# Altium project Parking_Guidance_stm.PrjPcb
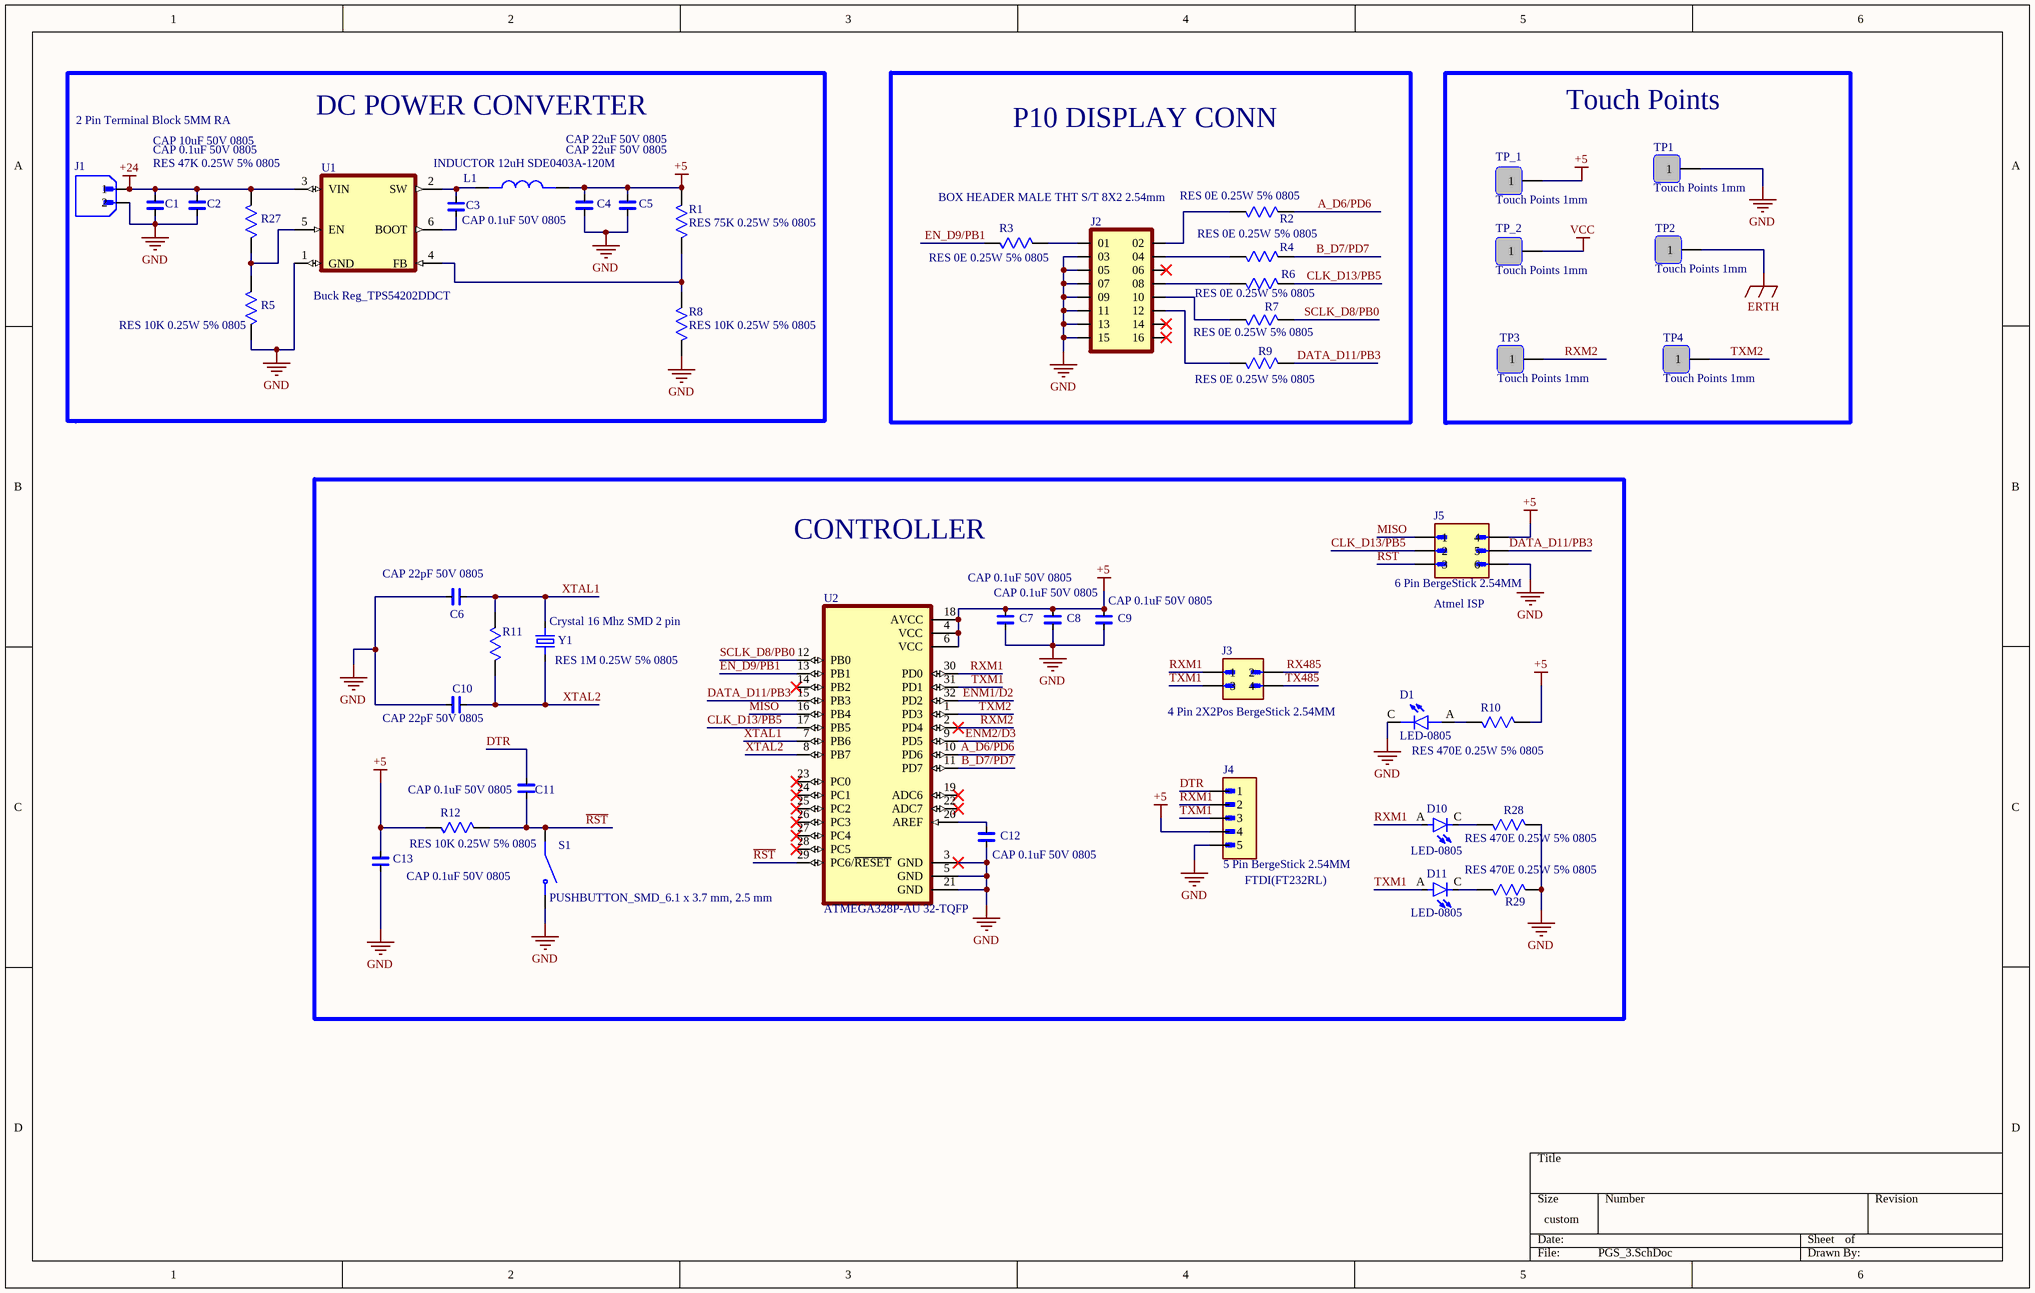
[diagram p0: PGS_3.SchDoc]
2 sheets, 101 parts. Net scope: global (net labels, ports and power ports of the same name join across sheets).
Board file: Parking_Guidance.PcbDoc
Sheets:
  PGS_3.SchDoc
  PGS_4.SchDoc

## Sheet PGS_3.SchDoc
size 381 x 241 mm; SheetNumber: 1; SheetTotal: 2

### Parts
C1  CAP 10uF 50V 0805  [CAP CER 0.1uF/50V 5%]
C2  CAP 0.1uF 50V 0805  [CAP CER 0.1uF/50V 5%]
C3  CAP 0.1uF 50V 0805  [CAP CER 0.1uF/50V 5%]
C4  CAP 22uF 50V 0805  [CAP CER 0.1uF/50V 5%]
C5  CAP 22uF 50V 0805  [CAP CER 0.1uF/50V 5%]
C6  CAP 22pF 50V 0805  [CAP CER 0.1uF/50V 5%]
C7  CAP 0.1uF 50V 0805  [CAP CER 0.1uF/50V 5%]
C8  CAP 0.1uF 50V 0805  [CAP CER 0.1uF/50V 5%]
C9  CAP 0.1uF 50V 0805  [CAP CER 0.1uF/50V 5%]
C10  CAP 22pF 50V 0805  [CAP CER 0.1uF/50V 5%]
C11  CAP 0.1uF 50V 0805  [CAP CER 0.1uF/50V 5%]
C12  CAP 0.1uF 50V 0805  [CAP CER 0.1uF/50V 5%]
C13  CAP 0.1uF 50V 0805  [CAP CER 0.1uF/50V 5%]
D1  LED-0805  [LED-0805]
D10  LED-0805  [LED-0805]
D11  LED-0805  [LED-0805]
J1  2 Pin Terminal Block 5MM RA  [2 Pin Terminal Block 5MM RA]
J2  BOX HEADER MALE THT S/T 8X2 2.54mm  [BOX HEADER MALE 8X2 2.54mm]
J3  4 Pin 2X2Pos BergeStick 2.54MM  [4 Pin BergeStick 2.54MM]
J4  5 Pin BergeStick 2.54MM  [5 Pin BergeStick 2.54MM]
J5  6 Pin BergeStick 2.54MM  [6 Pin BergeStick 2.54MM - duplicate]
L1  INDUCTOR 12uH SDE0403A-120M  [INDUCTOR 12uH SDE0403A-120M]
R1  RES 75K 0.25W 5% 0805  [RES 0805 10K/0.25W 5%]
R2  RES 0E 0.25W 5% 0805  [RES 0805 10K/0.25W 5%]
R3  RES 0E 0.25W 5% 0805  [RES 0805 10K/0.25W 5%]
R4  RES 0E 0.25W 5% 0805  [RES 0805 10K/0.25W 5%]
R5  RES 10K 0.25W 5% 0805  [RES 0805 10K/0.25W 5%]
R6  RES 0E 0.25W 5% 0805  [RES 0805 10K/0.25W 5%]
R7  RES 0E 0.25W 5% 0805  [RES 0805 10K/0.25W 5%]
R8  RES 10K 0.25W 5% 0805  [RES 0805 10K/0.25W 5%]
R9  RES 0E 0.25W 5% 0805  [RES 0805 10K/0.25W 5%]
R10  RES 470E 0.25W 5% 0805  [RES 0805 10K/0.25W 5%]
R11  RES 1M 0.25W 5% 0805  [RES 0805 10K/0.25W 5%]
R12  RES 10K 0.25W 5% 0805  [RES 0805 10K/0.25W 5%]
R27  RES 47K 0.25W 5% 0805  [RES 0805 10K/0.25W 5%]
R28  RES 470E 0.25W 5% 0805  [RES 0805 10K/0.25W 5%]
R29  RES 470E 0.25W 5% 0805  [RES 0805 10K/0.25W 5%]
S1  PUSHBUTTON_SMD_6.1 x 3.7 mm, 2.5 mm  [PUSHBUTTON_SMD_6.1 x 3.7 mm, 2.5 mm]
TP1  Touch Points 1mm  [Touch Points 1mm]
TP2  Touch Points 1mm  [Touch Points 1mm]
TP3  Touch Points 1mm  [Touch Points 1mm]
TP4  Touch Points 1mm  [Touch Points 1mm]
TP_1  Touch Points 1mm  [Touch Points 1mm]
TP_2  Touch Points 1mm  [Touch Points 1mm]
U1  Buck Reg_TPS54202DDCT  [Buck Reg_TPS54202DDCT]
U2  ATMEGA328P-AU 32-TQFP  [ATMEGA328P-AU 32-TQFP]
Y1  Crystal 16 Mhz SMD 2 pin  [Crystal 16 Mhz SMD 2 pin]

### Blocks framed on the sheet
DC POWER CONVERTER: C1-C5 J1 L1 R1 R5 R8 R27 U1
P10 DISPLAY CONN: J2 R2-R4 R6 R7 R9
Touch Points: TP1-TP4 TP_1 TP_2
CONTROLLER: C6-C13 D1 D10 D11 J3-J5 R10-R12 R28 R29 S1 U2 Y1

### Nets
+5: C4.2 C5.2 C7.2 C8.2 C9.2 C13.2 J4.4 J5.4 L1.2 R1.2 R10.2 R12.1 TP_1.1 U2.4(VCC) U2.6(VCC) U2.18(AVCC)
+24: C1.2 C2.2 J1.1 R27.2 U1.3(VIN)
ERTH: TP2.1  [project net EARTH]
GND: C1.1 C2.1 C4.1 C5.1 C6.1 C7.1 C8.1 C9.1 C10.1 C12.1 C13.1 D1.C J1.2 J2.03 J2.05 J2.07 J2.09 J2.11 J2.13 J2.15 J4.5 J5.6 R5.1 R8.1 R28.2 R29.2 S1.2 TP1.1 U1.1(GND) U2.3(GND) U2.5(GND) U2.21(GND)
VCC: TP_2.1
A_D6/PD6: R2.2 U2.10(PD6)
B_D7/PD7: R4.2 U2.11(PD7)
CLK_D13/PB5: J5.2 R6.2 U2.17(PB5)
DATA_D11/PB3: J5.5 R9.2 U2.15(PB3)
DTR: C11.2 J4.1
EN_D9/PB1: R3.1 U2.13(PB1)
ENM1/D2: U2.32(PD2)
ENM2/D3: U2.9(PD5)
MISO: J5.1 U2.16(PB4)
~{RST}: C11.1 J5.3 R12.2 S1.1 U2.29(PC6/~{RESET})
RX485: J3.2
RXM1: D10.A J3.1 J4.2 U2.30(PD0)
RXM2: TP3.1 U2.2(PD4)
SCLK_D8/PB0: R7.2 U2.12(PB0)
TX485: J3.4
TXM1: D11.A J3.3 J4.3 U2.31(PD1)
TXM2: TP4.1 U2.1(PD3)
XTAL1: C6.2 R11.2 U2.7(PB6) Y1.2
XTAL2: C10.2 R11.1 U2.8(PB7) Y1.1
NetC3_1: C3.1 U1.6(BOOT)
NetC3_2: C3.2 L1.1 U1.2(SW)
NetC12_2: C12.2 U2.20(AREF)
NetD1_A: D1.A R10.1
NetD10_C: D10.C R28.1
NetD11_C: D11.C R29.1
NetJ2_01: J2.01 R3.2
NetJ2_02: J2.02 R2.1
NetJ2_04: J2.04 R4.1
NetJ2_08: J2.08 R6.1
NetJ2_10: J2.10 R7.1
NetJ2_12: J2.12 R9.1
NetR1_1: R1.1 R8.2 U1.4(FB)
NetR5_2: R5.2 R27.1 U1.5(EN)

Not connected (* = marked no-connect by the designer): J2 06* 14* 16*; U2 14(PB2)* 19(ADC6)* 22(ADC7)* 23(PC0)* 24(PC1)* 25(PC2)* 26(PC3)* 27(PC4)* 28(PC5)*

### Notes on the sheet
- (near J5) Atmel ISP
- (near J4) FTDI(FT232RL)

### Library data of the parts
C1-C13 = CAP CER 0.1uF/50V 5%: CAP CER 0.1uF/50V  Ceramic Capacitor X7R 0805 (2012 Metric); MF: Samsung; MP: CL21B104KCFNNNE; Purchase-URL: https://pricing.snapeda.com/search?q=CL21B104KCFNNNE&ref=eda; Package: 0805 Samsung; Check_prices: https://www.snapeda.com/parts/CL21B104KCFNNNE/Samsung+Electro-Mechanics/view-part/?ref=eda; Value: *; SnapEDA_Link: https://www.snapeda.com/parts/CL21B104KCFNNNE/Samsung+Electro-Mechanics/view-part/?ref=snap; Digi-Key_Part_Number: 1276-6840-2-ND
D1 = LED-0805: Red 640nm LED Indication - Discrete 1.85V 0805 (2012 Metric) APT2012SRCPRV; MF: Kingbright; SnapEDA_Link: https://www.snapeda.com/parts/APT2012SRCPRV/Kingbright/view-part/?ref=snap; Package: 0805 Kingbright; Value: *; MP: APT2012SRCPRV; Check_prices: https://www.snapeda.com/parts/APT2012SRCPRV/Kingbright/view-part/?ref=eda
D10 D11 = LED-0805: Red 640nm LED Indication - Discrete 1.85V 0805 (2012 Metric) SMT APT2012SRCPRV; MF: Kingbright; SnapEDA_Link: https://www.snapeda.com/parts/APT2012SRCPRV/Kingbright/view-part/?ref=snap; Package: 0805 Kingbright; Value: *; MP: APT2012SRCPRV; Check_prices: https://www.snapeda.com/parts/APT2012SRCPRV/Kingbright/view-part/?ref=eda
J1 = 2 Pin Terminal Block 5MM RA: 2 Pin Terminal Block HDR 5MM THT RA _OQ0271510000G; MF: Amphenol Anytek; SnapEDA_Link: https://www.snapeda.com/parts/OQ0271510000G/Amphenol/view-part/?ref=snap; Package: None; Value: *; MP: OQ0271510000G; Check_prices: https://www.snapeda.com/parts/OQ0271510000G/Amphenol/view-part/?ref=eda
J2 = BOX HEADER MALE THT S/T 8X2 2.54mm: THT BOX HEADER MALE S/T 8X2 2.54mm 16 pin; MP: TSS-108-01-T-D; Availability: Unavailable; Value: *; Price: None; Package: None
J3 = 4 Pin 2X2Pos BergeStick 2.54MM: 4 Pin 2X2Pos THT S/T BergeStick 2.54MM Amphenol 67997-104HLF 3A; MF: Amphenol ICC; Value: *; Package: None; Purchase-URL: https://pricing.snapeda.com/search/part/67997-104HLF/?ref=eda; Digi-Key_Part_Number: 609-3225-ND; Check_prices: https://www.snapeda.com/parts/67997-104HLF/Amphenol+FCI/view-part/?ref=eda; MP: 67997-104HLF; SnapEDA_Link: https://www.snapeda.com/parts/67997-104HLF/Amphenol+FCI/view-part/?ref=snap
J4 = 5 Pin BergeStick 2.54MM: 5 Pin 5Pos THT S/T BergeStick 2.54MM Amphenol68002-405HLF 3A; Package: None; Price: None; Value: *; MP: 68002-405HLF; Availability: Unavailable
J5 = 6 Pin BergeStick 2.54MM_1: 6 Pin 3X3Pos THT S/T BergeStick 2.54MM Amphenol 69192-406HLF; MF: AMPHENOL ICC / FCI; Package: None; Digi-Key_Part_Number: 609-4711-ND; Check_prices: https://www.snapeda.com/parts/69192-406HLF/Amphenol/view-part/?ref=eda; Value: *; MP: 69192-406HLF; Purchase-URL: https://pricing.snapeda.com/search/part/69192-406HLF/?ref=eda; SnapEDA_Link: https://www.snapeda.com/parts/69192-406HLF/Amphenol/view-part/?ref=snap
L1 = INDUCTOR 12uH SDE0403A-120M: INDUCTOR_2020(5.5mmX4.5mm)  SMT INDUCTOR 12uH SDE0403A-120M0 LQH5BPB4R7NT0L; Package: None; Price: None; Value: *; MP: LQH5BPB4R7NT0L; Availability: Unavailable
R1-R12 R27 = RES 10K 0.25W 5% 0805: RESISTOR, THICK FILM, 10K, 5%, 0805 0.25W; MP: ERJ-6GEYJ103V; MF: Panasonic Electronic; Price: None; Check_prices: https://www.snapeda.com/parts/ERJ-6GEYJ103V/Panasonic+Electronic+Components/view-part/?ref=eda; Package: 805-2 Panasonic; Purchase-URL: https://pricing.snapeda.com/search/part/ERJ-6GEYJ103V/?ref=eda; Availability: In Stock; SnapEDA_Link: https://www.snapeda.com/parts/ERJ-6GEYJ103V/Panasonic+Electronic+Components/view-part/?ref=snap; Value: *
R28 R29 = RES 10K 0.25W 5% 0805: RESISTOR, THICK FILM, 10K, 5%, 0805 0.25W SMT; MP: ERJ-6GEYJ103V; MF: Panasonic Electronic; Price: None; Check_prices: https://www.snapeda.com/parts/ERJ-6GEYJ103V/Panasonic+Electronic+Components/view-part/?ref=eda; Package: 805-2 Panasonic; Purchase-URL: https://pricing.snapeda.com/search/part/ERJ-6GEYJ103V/?ref=eda; Availability: In Stock; SnapEDA_Link: https://www.snapeda.com/parts/ERJ-6GEYJ103V/Panasonic+Electronic+Components/view-part/?ref=snap; Value: *
S1 = PUSHBUTTON_SMD_6.1 x 3.7 mm, 2.5 mm: 6.1 x 3.7 mm, 2.5 mm Actuator Height, 260 gf, Red, Surface Mount, SPST, Tactile Switch, TS09-63-25-R-260-SMT-TR; MF: Same Sky; SnapEDA_Link: https://www.snapeda.com/parts/TS09-63-25-R-260-SMT-TR/Same+Sky/view-part/?ref=snap; Package: None; Value: *; MP: TS09-63-25-R-260-SMT-TR; Check_prices: https://www.snapeda.com/parts/TS09-63-25-R-260-SMT-TR/Same+Sky/view-part/?ref=eda
TP1-TP4 TP_1 TP_2 = Touch Points: Touch Points 0.75mm to1mm
U1 = TPS54202DDCT: 4.5V to 28V Input, 2A Output, EMI Friendly Synchronous Step-Down Converter TPS54202DDCT; MF: Texas Instruments; SnapEDA_Link: https://www.snapeda.com/parts/TPS54202DDCT/Texas+Instruments/view-part/?ref=snap; Package: SOT-23-THN-6 Texas Instruments; Value: *; MP: TPS54202DDCT; Check_prices: https://www.snapeda.com/parts/TPS54202DDCT/Texas+Instruments/view-part/?ref=eda
U2 = ATMEGA328P-AU_1: AVR AVRÂ® ATmega Microcontroller IC 8-Bit 20MHz 32KB (16K x 16) FLASH 32-TQFP (7x7); MF: Microchip; SnapEDA_Link: https://www.snapeda.com/parts/ATMEGA328P-AU/Microchip/view-part/?ref=snap; Package: TQFP-32 Microchip; Value: *; MP: ATMEGA328P-AU; Check_prices: https://www.snapeda.com/parts/ATMEGA328P-AU/Microchip/view-part/?ref=eda
Y1 = Crystal 16 Mhz SMD 2 pin_1: 16 MHz Â±30ppm Crystal 20pF 60 Ohms HC-49/US FOXSDLF/128-20 16 Mhz Crystal SMD –CSM-4ALX(28ALX) 12.5mmX4.85mmX4mm; MF: Fox Electronics; SnapEDA_Link: https://www.snapeda.com/parts/FOXSDLF/128-20/Fox+Electronics/view-part/?ref=snap; Package: HC49SD Fox Electronics; Value: *; MP: FOXSDLF/128-20; Check_prices: https://www.snapeda.com/parts/FOXSDLF/128-20/Fox+Electronics/view-part/?ref=eda

## Sheet PGS_4.SchDoc
size 381 x 241 mm; SheetNumber: 2; SheetTotal: 2
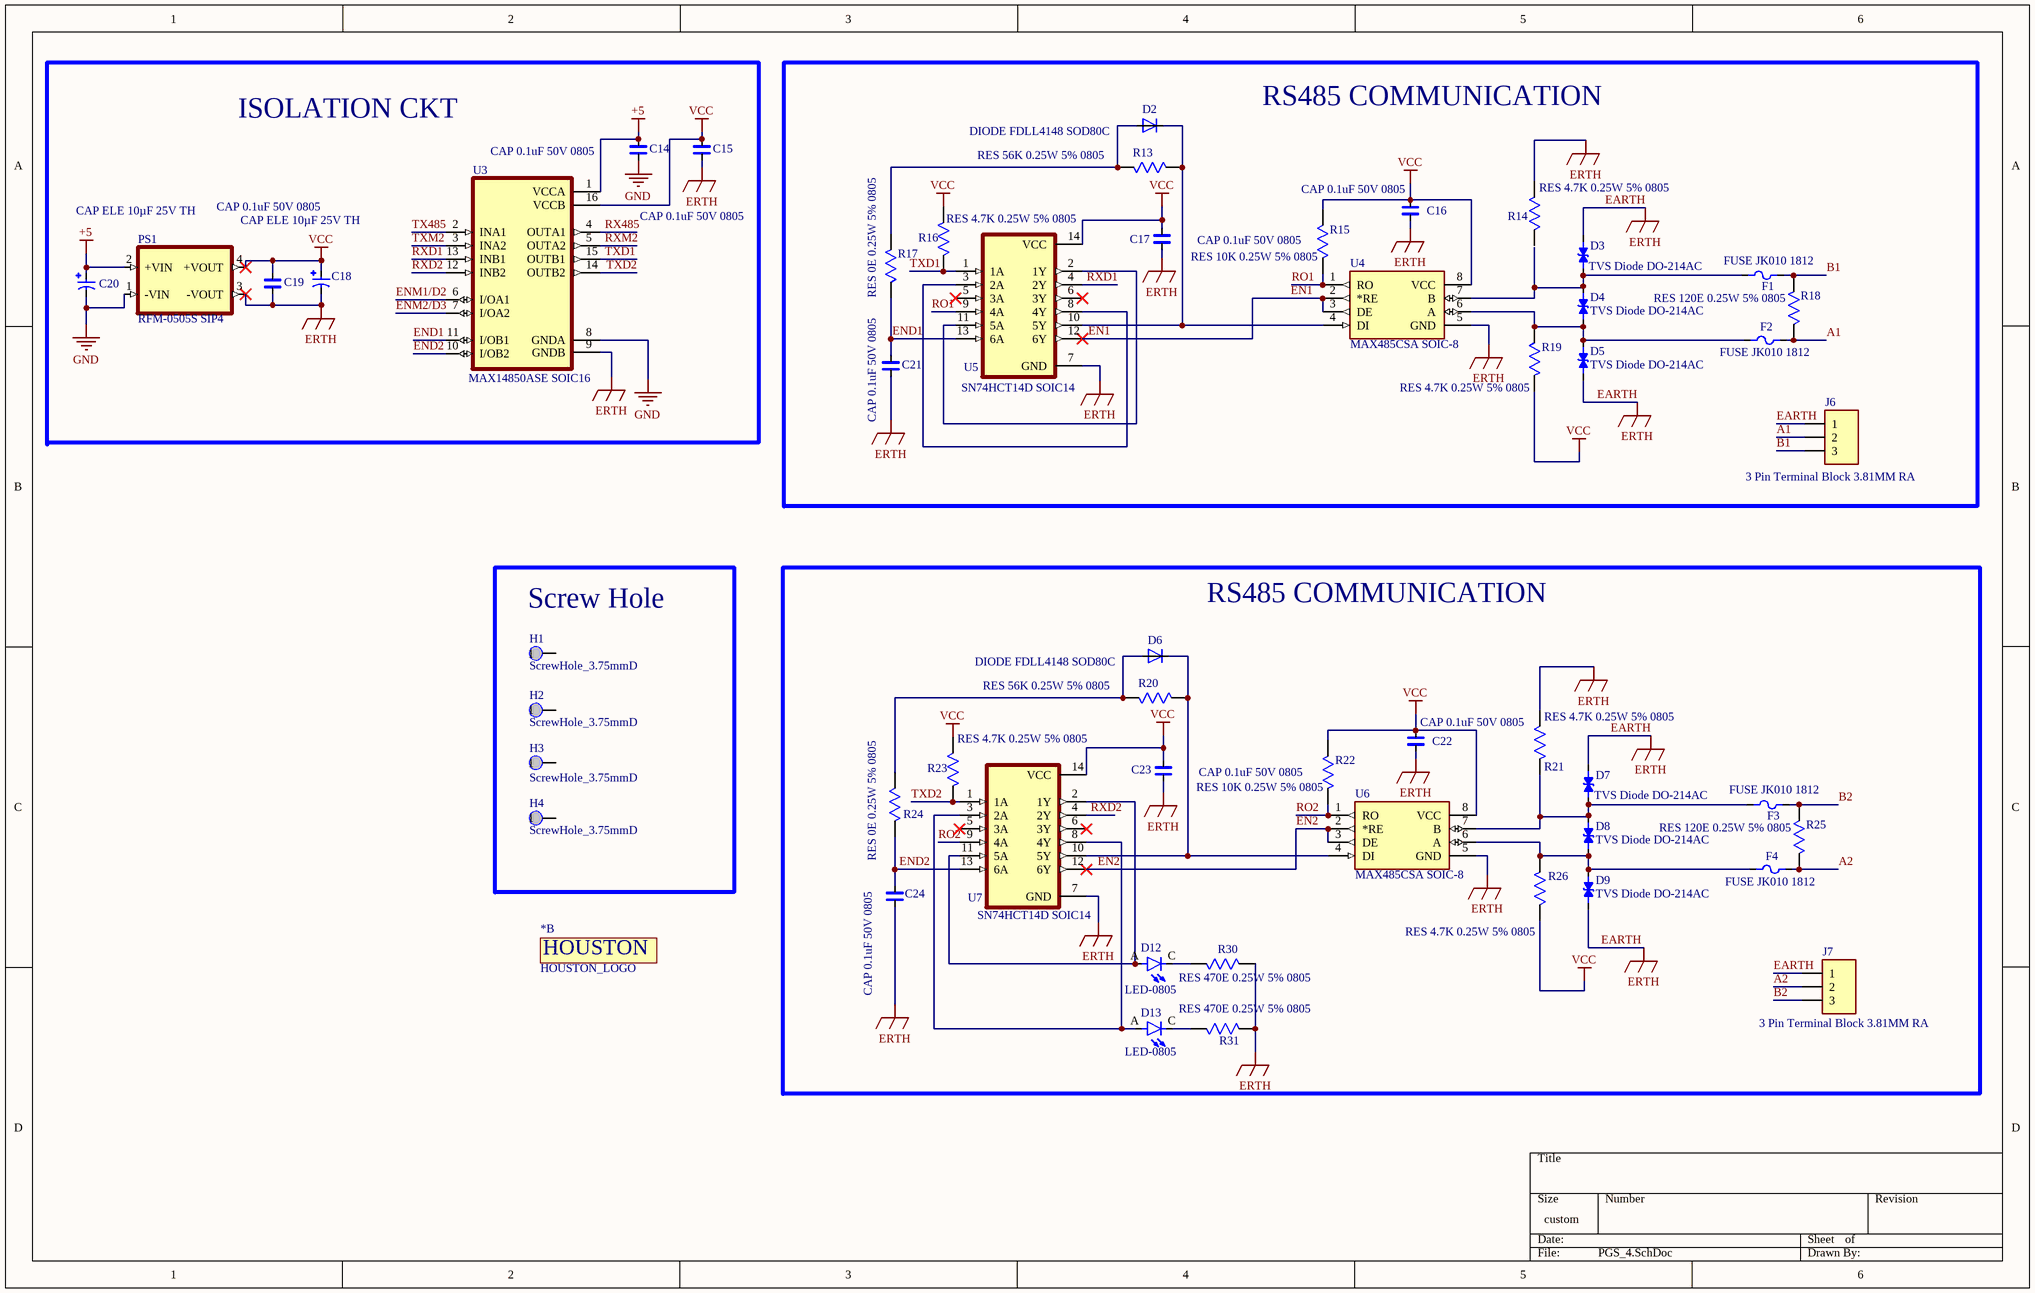
[diagram p1: PGS_4.SchDoc]

### Parts
*  HOUSTON_LOGO  [HOUSTON_LOGO]  (part B of 2)
C14  CAP 0.1uF 50V 0805  [CAP CER 0.1uF/50V 5%]
C15  CAP 0.1uF 50V 0805  [CAP CER 0.1uF/50V 5%]
C16  CAP 0.1uF 50V 0805  [CAP CER 0.1uF/50V 5%]
C17  CAP 0.1uF 50V 0805  [CAP CER 0.1uF/50V 5%]
C18  CAP ELE 10µF 25V TH  [CAP ELE 10µF 25V TH]
C19  CAP 0.1uF 50V 0805  [CAP CER 0.1uF/50V 5%]
C20  CAP ELE 10µF 25V TH  [CAP ELE 10µF 25V TH]
C21  CAP 0.1uF 50V 0805  [CAP CER 0.1uF/50V 5%]
C22  CAP 0.1uF 50V 0805  [CAP CER 0.1uF/50V 5%]
C23  CAP 0.1uF 50V 0805  [CAP CER 0.1uF/50V 5%]
C24  CAP 0.1uF 50V 0805  [CAP CER 0.1uF/50V 5%]
D2  DIODE FDLL4148 SOD80C  [DIODE SOD80C]
D3  TVS Diode DO-214AC  [TVS Diode DO-214AC]
D4  TVS Diode DO-214AC  [TVS Diode DO-214AC]
D5  TVS Diode DO-214AC  [TVS Diode DO-214AC]
D6  DIODE FDLL4148 SOD80C  [DIODE SOD80C]
D7  TVS Diode DO-214AC  [TVS Diode DO-214AC]
D8  TVS Diode DO-214AC  [TVS Diode DO-214AC]
D9  TVS Diode DO-214AC  [TVS Diode DO-214AC]
D12  LED-0805  [LED-0805]
D13  LED-0805  [LED-0805]
F1  FUSE JK010 1812  [FUSE JK010 1812]
F2  FUSE JK010 1812  [FUSE JK010 1812]
F3  FUSE JK010 1812  [FUSE JK010 1812]
F4  FUSE JK010 1812  [FUSE JK010 1812]
H1  ScrewHole_3.75mmD  [ScrewHole_3.75mmD - duplicate]
H2  ScrewHole_3.75mmD  [ScrewHole_3.75mmD - duplicate]
H3  ScrewHole_3.75mmD  [ScrewHole_3.75mmD - duplicate]
H4  ScrewHole_3.75mmD  [ScrewHole_3.75mmD - duplicate]
J6  3 Pin Terminal Block 3.81MM RA  [3 Pin Terminal Block 3.81MM RA]
J7  3 Pin Terminal Block 3.81MM RA  [3 Pin Terminal Block 3.81MM RA]
PS1  RFM-0505S SIP4  [RFM-0505S]
R13  RES 56K 0.25W 5% 0805  [RES 0805 10K/0.25W 5%]
R14  RES 4.7K 0.25W 5% 0805  [RES 0805 10K/0.25W 5%]
R15  RES 10K 0.25W 5% 0805  [RES 0805 10K/0.25W 5%]
R16  RES 4.7K 0.25W 5% 0805  [RES 0805 10K/0.25W 5%]
R17  RES 0E 0.25W 5% 0805  [RES 0805 10K/0.25W 5%]
R18  RES 120E 0.25W 5% 0805  [RES 0805 10K/0.25W 5%]
R19  RES 4.7K 0.25W 5% 0805  [RES 0805 10K/0.25W 5%]
R20  RES 56K 0.25W 5% 0805  [RES 0805 10K/0.25W 5%]
R21  RES 4.7K 0.25W 5% 0805  [RES 0805 10K/0.25W 5%]
R22  RES 10K 0.25W 5% 0805  [RES 0805 10K/0.25W 5%]
R23  RES 4.7K 0.25W 5% 0805  [RES 0805 10K/0.25W 5%]
R24  RES 0E 0.25W 5% 0805  [RES 0805 10K/0.25W 5%]
R25  RES 120E 0.25W 5% 0805  [RES 0805 10K/0.25W 5%]
R26  RES 4.7K 0.25W 5% 0805  [RES 0805 10K/0.25W 5%]
R30  RES 470E 0.25W 5% 0805  [RES 0805 10K/0.25W 5%]
R31  RES 470E 0.25W 5% 0805  [RES 0805 10K/0.25W 5%]
U3  MAX14850ASE SOIC16  [MAX14850ASE]
U4  MAX485CSA SOIC-8  [MAX485CSA]
U5  SN74HCT14D SOIC14  [SN74HCT14D SOIC14]
U6  MAX485CSA SOIC-8  [MAX485CSA]
U7  SN74HCT14D SOIC14  [SN74HCT14D SOIC14]

### Blocks framed on the sheet
ISOLATION CKT: C14 C15 C18-C20 PS1 U3
RS485 COMMUNICATION: C16 C17 C21 D2-D5 F1 F2 J6 R13-R19 U4 U5
Screw Hole: H1-H4
RS485 COMMUNICATION: C22-C24 D6-D9 D12 D13 F3 F4 J7 R20-R26 R30 R31 U6 U7

### Nets
+5: C14.2 C20.P PS1.2(+VIN) U3.1(VCCA)
EARTH: C15.1 C16.1 C17.1 C18.N C19.1 C21.1 C22.1 C23.1 C24.1 D3.2 D5.1 D7.2 D9.1 J6.1 J7.1 PS1.3(-VOUT) R14.2 R21.2 R30.2 R31.2 U3.9(GNDB) U4.5(GND) U5.7(GND) U6.5(GND) U7.7(GND)  [also labelled ERTH]
GND: C14.1 C20.N PS1.1(-VIN) U3.8(GNDA)
VCC: C15.2 C16.2 C17.2 C18.P C19.2 C22.2 C23.2 PS1.4(+VOUT) R15.2 R16.2 R19.1 R22.2 R23.2 R26.1 U3.16(VCCB) U4.8(VCC) U5.14(VCC) U6.8(VCC) U7.14(VCC)
A1: F2.2 J6.2 R18.1
A2: F4.2 J7.2 R25.1
B1: F1.2 J6.3 R18.2
B2: F3.2 J7.3 R25.2
EN1: U4.2(*RE) U4.3(DE) U5.12(6Y)
EN2: U6.2(*RE) U6.3(DE) U7.12(6Y)
END1: C21.2 R17.1 U3.11(I/OB1) U5.13(6A)
END2: C24.2 R24.1 U3.10(I/OB2) U7.13(6A)
ENM1/D2: U3.6(I/OA1)
ENM2/D3: U3.7(I/OA2)
RO1: R15.1 U4.1(RO) U5.9(4A)
RO2: R22.1 U6.1(RO) U7.9(4A)
RX485: U3.4(OUTA1)
RXD1: U3.13(INB1) U5.4(2Y)
RXD2: U3.12(INB2) U7.4(2Y)
RXM2: U3.5(OUTA2)
TX485: U3.2(INA1)
TXD1: R16.1 U3.15(OUTB1) U5.1(1A)
TXD2: R23.1 U3.14(OUTB2) U7.1(1A)
TXM2: U3.3(INA2)
NetD2_1: D2.1(K) R13.1 U4.4(DI) U5.10(5Y)
NetD2_2: D2.2(A) R13.2 R17.2
NetD3_1: D3.1 D4.2 F1.1 U4.7(B)
NetD4_1: D4.1 D5.2 F2.1 R19.2 U4.6(A)
NetD6_1: D6.1(K) R20.1 U6.4(DI) U7.10(5Y)
NetD6_2: D6.2(A) R20.2 R24.2
NetD7_1: D7.1 D8.2 F3.1 R21.1 U6.7(B)
NetD8_1: D8.1 D9.2 F4.1 R26.2 U6.6(A)
NetD12_A: D12.A U7.2(1Y) U7.11(5A)
NetD12_C: D12.C R30.1
NetD13_A: D13.A U7.3(2A) U7.8(4Y)
NetD13_C: D13.C R31.1
NetU5_2: U5.2(1Y) U5.11(5A)
NetU5_3: U5.3(2A) U5.8(4Y)

Not connected (* = marked no-connect by the designer): H1 1; H2 1; H3 1; H4 1; R14 1; U5 5(3A)* 6(3Y)*; U7 5(3A)* 6(3Y)*

### Notes on the sheet
- (in symbol HOUSTON_LOGO, part B) HOUSTON

### Library data of the parts
C14-C17 C19 C21-C24 = CAP CER 0.1uF/50V 5%: as C1 on sheet PGS_3; Purchase-URL: https://pricing.snapeda.com/search?q=CL21B104KCFNNNE&ref=eda; Package: 0805 Samsung; Check_prices: https://www.snapeda.com/parts/CL21B104KCFNNNE/Samsung+Electro-Mechanics/view-part/?ref=eda; Value: *; SnapEDA_Link: https://www.snapeda.com/parts/CL21B104KCFNNNE/Samsung+Electro-Mechanics/view-part/?ref=snap; Digi-Key_Part_Number: 1276-6840-2-ND
C18 C20 = CAP ELE 10µF 25V TH: 10µF 25V Aluminum Electrolytic Capacitors Radial Lead Type TH, Dia-5mm, Pitch-2mm ECEA1EN100UI; MF: Panasonic; Package: RADIAL-2 Panasonic; Purchase-URL: https://pricing.snapeda.com/search/part/ECEA1EN100UI/?ref=eda; Value: *; Digi-Key_Part_Number: ECE-A1EN100UI-ND; SnapEDA_Link: https://www.snapeda.com/parts/ECEA1EN100UI/Panasonic/view-part/5788532/?ref=snap; MP: ECEA1EN100UI; Check_prices: https://www.snapeda.com/parts/ECEA1EN100UI/Panasonic/view-part/5788532/?ref=eda
D2 D6 = DIODE FDLL4148 SOD80C: FDLL4148 Diode Standard 75V 200mA _DC_ Surface Mount LLDS; MiniMelf DIODE SOD80C PMLL4148L; MF: Nexperia USA; Value: *; Price: None; Package: SOD-80 NXP Semiconductors; SnapEDA_Link: https://www.snapeda.com/parts/PMLL4148L/Nexperia%20USA%20Inc./view-part/9225/?ref=snap; Availability: Unavailable; MP: PMLL4148L
D3-D5 D7-D9 = TVS Diode DO-214AC: TVS Diode BiDirectional LittileFuse 1.5SMC6.8CA DO-214AC 6V8C; MP: SMAJ7.5CA; Availability: Unavailable; Package: None; Value: *; Price: None
D12 D13 = LED-0805: as D10 on sheet PGS_3; SnapEDA_Link: https://www.snapeda.com/parts/APT2012SRCPRV/Kingbright/view-part/?ref=snap; Package: 0805 Kingbright; Value: *; MP: APT2012SRCPRV; Check_prices: https://www.snapeda.com/parts/APT2012SRCPRV/Kingbright/view-part/?ref=eda
F1-F4 = FUSE JK010 1812: FUSE JK010 Polymeric PTC Resettable Fuse 60V 100 mA 0.8W Ih Surface Mount 1812 (4532 Metric), Concave HUAAN MF-MSMF010-60V; MP: MF-MSMF010-2; MF: Bourns; Price: None; Availability: In Stock; Package: 1812 Bourns; SnapEDA_Link: https://www.snapeda.com/parts/MF-MSMF010-2/Bourns/view-part/?ref=snap; Check_prices: https://www.snapeda.com/parts/MF-MSMF010-2/Bourns/view-part/?ref=eda; Value: *; Purchase-URL: https://pricing.snapeda.com/search/part/MF-MSMF010-2/?ref=eda
H1-H4 = ScrewHole_3.75mmD: SCREW HEAD DIA 4.5MM, SREW LEG DIA 3 MM
J6 J7 = 3 Pin Terminal Block 3.81MM RA: 3 Pin Terminal Block HDR 3.81MM THT RA 284513-3; MF: TE Connectivity; Purchase-URL: https://pricing.snapeda.com/search/part/284513-3/?ref=eda; Package: None; MP: 284513-3; EU_RoHS_Compliance: Compliant; Price: None; Availability: In Stock; Value: *; Check_prices: https://www.snapeda.com/parts/284513-3/TE+Connectivity+AMP+Connectors/view-part/?ref=eda; SnapEDA_Link: https://www.snapeda.com/parts/284513-3/TE+Connectivity+AMP+Connectors/view-part/?ref=snap
PS1 = RFM-0505S: DC-DC Converter/Isolator, SIP4, 1kV unreg, Single Output, 1W, 5V Out, RFM Series | RECOM Power Inc. RFM-0505S; SnapEDA_Link: https://www.snapeda.com/parts/RFM-0505S/Recom+Power/view-part/?ref=snap; Package: SIP-4 Recom Power; Value: *; MF: Recom Power; MP: RFM-0505S; Check_prices: https://www.snapeda.com/parts/RFM-0505S/Recom+Power/view-part/?ref=eda
R13-R26 = RES 10K 0.25W 5% 0805: as R1 on sheet PGS_3; Price: None; Check_prices: https://www.snapeda.com/parts/ERJ-6GEYJ103V/Panasonic+Electronic+Components/view-part/?ref=eda; Package: 805-2 Panasonic; Purchase-URL: https://pricing.snapeda.com/search/part/ERJ-6GEYJ103V/?ref=eda; Availability: In Stock; SnapEDA_Link: https://www.snapeda.com/parts/ERJ-6GEYJ103V/Panasonic+Electronic+Components/view-part/?ref=snap; Value: *
R30 R31 = RES 10K 0.25W 5% 0805: as R28 on sheet PGS_3; Price: None; Check_prices: https://www.snapeda.com/parts/ERJ-6GEYJ103V/Panasonic+Electronic+Components/view-part/?ref=eda; Package: 805-2 Panasonic; Purchase-URL: https://pricing.snapeda.com/search/part/ERJ-6GEYJ103V/?ref=eda; Availability: In Stock; SnapEDA_Link: https://www.snapeda.com/parts/ERJ-6GEYJ103V/Panasonic+Electronic+Components/view-part/?ref=snap; Value: *
U3 = MAX14850ASE+T: MAX14850ASE SOIC16 Six-Channel Digital Isolator; MF: Analog Devices; SnapEDA_Link: https://www.snapeda.com/parts/MAX14850ASE+T/Analog+Devices/view-part/?ref=snap; Package: SOIC-16 Maxim Integrated; Value: *; MP: MAX14850ASE+T; Check_prices: https://www.snapeda.com/parts/MAX14850ASE+T/Analog+Devices/view-part/?ref=eda
U4 U6 = MAX485CSA: MAX485CSA-RS-485/RS-422 Transceivers, SOIC-8; MF: Analog Devices; MP: MAX485CSA+; SnapEDA_Link: https://www.snapeda.com/parts/MAX485CSA+/Analog+Devices/view-part/?ref=snap; Package: SOIC-8 Maxim; Value: *; Check_prices: https://www.snapeda.com/parts/MAX485CSA+/Analog+Devices/view-part/?ref=eda
U5 U7 = SN74HCT14D: SN74HCT14D SOIC14 6-ch, 4.5-V to 5.5-V inverters with Schmitt-Trigger inputs; MF: Texas Instruments; SnapEDA_Link: https://www.snapeda.com/parts/SN74HCT14D/Texas+Instruments/view-part/?ref=snap; Package: SOIC-14 Texas Instruments; Value: *; MP: SN74HCT14D; Check_prices: https://www.snapeda.com/parts/SN74HCT14D/Texas+Instruments/view-part/?ref=eda

## Nets that join several sheets
+5: PGS_3 (16 pins), PGS_4 (C14.2 C20.P PS1.2 U3.1)
EARTH: PGS_3 (TP2.1), PGS_4 (25 pins)
GND: PGS_3 (32 pins), PGS_4 (C14.1 C20.N PS1.1 U3.8)
VCC: PGS_3 (TP_2.1), PGS_4 (19 pins)
ENM1/D2: PGS_3 (U2.32), PGS_4 (U3.6)
ENM2/D3: PGS_3 (U2.9), PGS_4 (U3.7)
RX485: PGS_3 (J3.2), PGS_4 (U3.4)
RXM2: PGS_3 (TP3.1 U2.2), PGS_4 (U3.5)
TX485: PGS_3 (J3.4), PGS_4 (U3.2)
TXM2: PGS_3 (TP4.1 U2.1), PGS_4 (U3.3)